# Altium schematic sheet Radar_FMCW.SchDoc
size A3; SheetNumber: 1; SheetTotal: 1
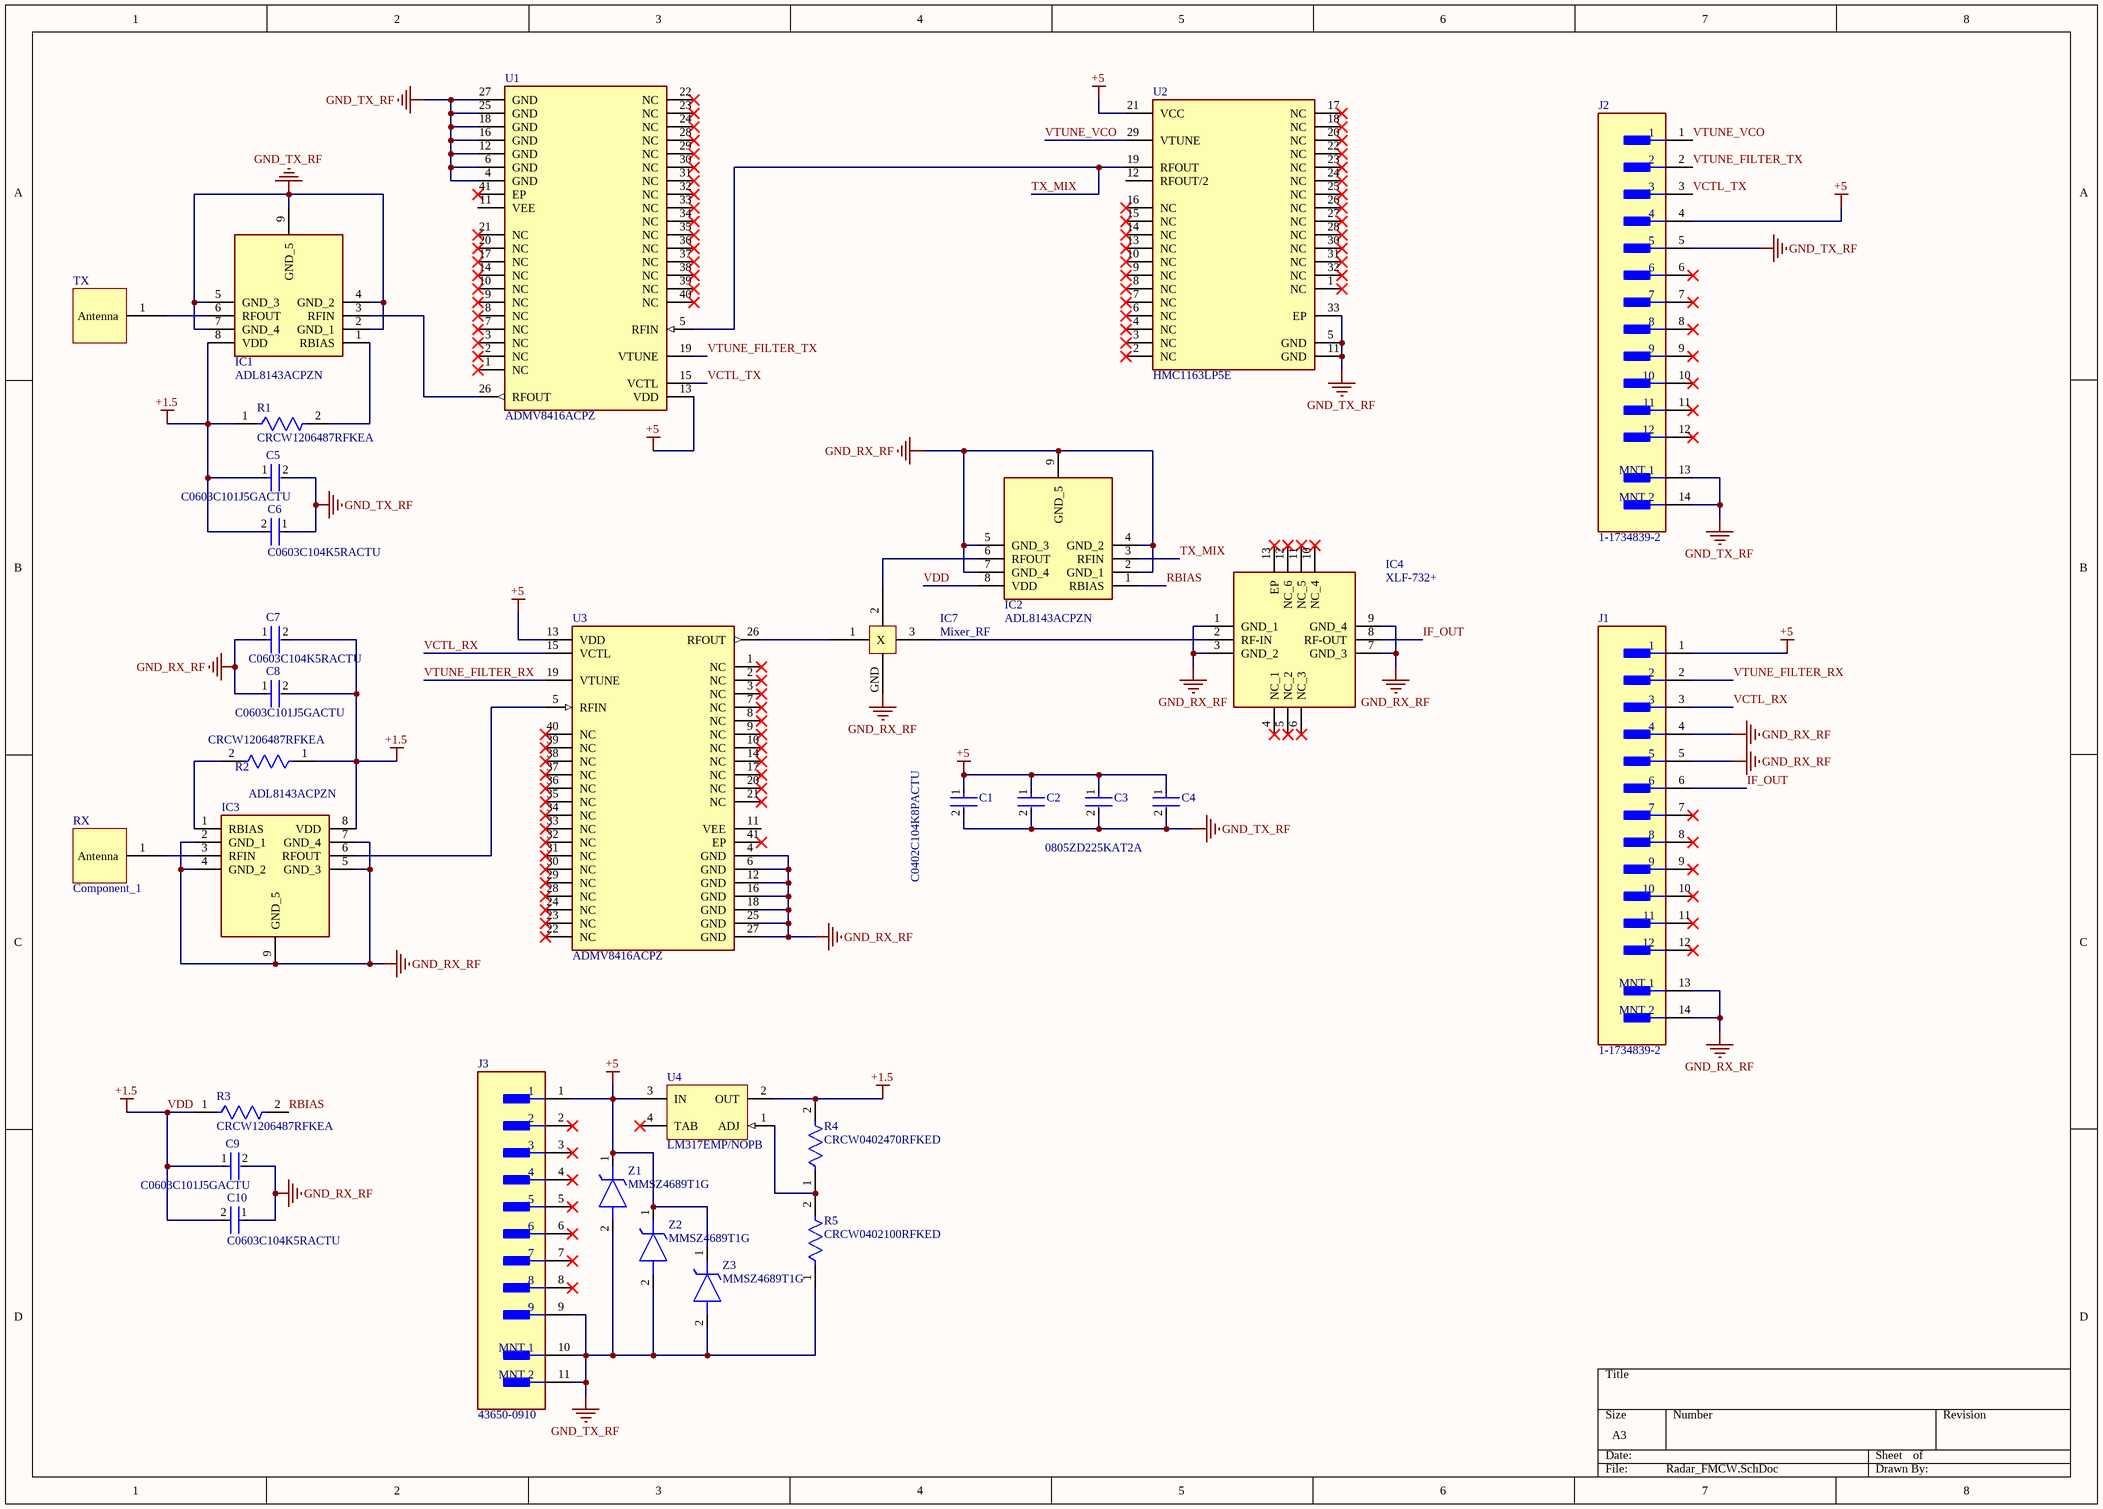
[diagram p0: Radar_FMCW.SchDoc]

## Parts
C1  C0402C104K8PACTU  [FP-C0402-BB-MFG]
C2  (no value)  [FP-0805-L_2_01_0_2-W_1_25-IPC_B]
C3  (no value)  [FP-0805-L_2_01_0_2-W_1_25-IPC_B]
C4  0805ZD225KAT2A  [FP-0805-L_2_01_0_2-W_1_25-IPC_B]
C5  C0603C101J5GACTU  [FP-C0603C-CF-MFG]
C6  C0603C104K5RACTU  [FP-C0603C-CF-MFG]
C7  C0603C104K5RACTU  [FP-C0603C-CF-MFG]
C8  C0603C101J5GACTU  [FP-C0603C-CF-MFG]
C9  C0603C101J5GACTU  [FP-C0603C-CF-MFG]
C10  C0603C104K5RACTU  [FP-C0603C-CF-MFG]
IC1  ADL8143ACPZN  [SON50P200X200X90-9N-D]
IC2  ADL8143ACPZN  [SON50P200X200X90-9N-D]
IC3  ADL8143ACPZN  [SON50P200X200X90-9N-D]
IC4  XLF-732+  [QFN51P300X300X89-13N]
IC7  Mixer_RF  [Mixer_RF]
J1  1-1734839-2  [FP-1-1734839-2-MFG]
J2  1-1734839-2  [FP-1-1734839-2-MFG]
J3  43650-0910  [FP-43650-0910-MFG]
R1  CRCW1206487RFKEA  [FP-CRCW1206-e3-MFG]
R2  CRCW1206487RFKEA  [FP-CRCW1206-e3-MFG]
R3  CRCW1206487RFKEA  [FP-CRCW1206-e3-MFG]
R4  CRCW0402470RFKED  [FP-CRCW0402-e3-MFG]
R5  CRCW0402100RFKED  [FP-CRCW0402-e3-IPC_C]
RX  Component_1  [Antenna_10GHz]
TX  (no value)  [Antenna_10GHz]
U1  ADMV8416ACPZ  [FP-CP-40-27-IPC_C]
U2  HMC1163LP5E  [FP-HCP-32-1-IPC_B]
U3  ADMV8416ACPZ  [FP-CP-40-27-IPC_C]
U4  LM317EMP/NOPB  [DCY0004A_L]
Z1  MMSZ4689T1G  [SOD3716X135N]
Z2  MMSZ4689T1G  [SOD3716X135N]
Z3  MMSZ4689T1G  [SOD3716X135N]

## Nets
+5: C1.1 C2.1 C3.1 C4.1 J1.1 J2.4 J3.1 U1.13(VDD) U2.21(VCC) U3.13(VDD) U4.3(IN) Z1.1(K) Z2.1(K) Z3.1(K)
GND_RX_RF: C7.1 C8.1 C9.2 C10.1 IC2.2(GND_1) IC2.4(GND_2) IC2.5(GND_3) IC2.7(GND_4) IC2.9(GND_5) IC3.2(GND_1) IC3.4(GND_2) IC3.5(GND_3) IC3.7(GND_4) IC3.9(GND_5) IC4.1(GND_1) IC4.3(GND_2) IC4.7(GND_3) IC4.9(GND_4) IC7.GND J1.4 J1.5 J1.13(MNT_1) J1.14(MNT_2) U3.4(GND) U3.6(GND) U3.12(GND) U3.16(GND) U3.18(GND) U3.25(GND) U3.27(GND)
GND_TX_RF: C1.2 C2.2 C3.2 C4.2 C5.2 C6.1 IC1.2(GND_1) IC1.4(GND_2) IC1.5(GND_3) IC1.7(GND_4) IC1.9(GND_5) J2.5 J2.13(MNT_1) J2.14(MNT_2) J3.9 J3.10(MNT_1) J3.11(MNT_2) R5.1 U1.4(GND) U1.6(GND) U1.12(GND) U1.16(GND) U1.18(GND) U1.25(GND) U1.27(GND) U2.5(GND) U2.11(GND) U2.33(EP) Z1.2(A) Z2.2(A) Z3.2(A)
VDD: C5.1 C6.2 C7.2 C8.2 C9.1 C10.2 IC1.8(VDD) IC2.8(VDD) IC3.8(VDD) R1.1 R2.1 R3.1 R4.2 U4.2(OUT)  [also labelled +1.5]
IF_OUT: IC4.8(RF-OUT) J1.6
RBIAS: IC2.1(RBIAS) R3.2
TX_MIX: IC2.3(RFIN) U1.5(RFIN) U2.19(RFOUT)
VCTL_RX: J1.3 U3.15(VCTL)
VCTL_TX: J2.3 U1.15(VCTL)
VTUNE_FILTER_RX: J1.2 U3.19(VTUNE)
VTUNE_FILTER_TX: J2.2 U1.19(VTUNE)
VTUNE_VCO: J2.1 U2.29(VTUNE)
NetIC1_1: IC1.1(RBIAS) R1.2
NetIC1_3: IC1.3(RFIN) U1.26(RFOUT)
NetIC1_6: IC1.6(RFOUT) TX.1(Antenna)
NetIC2_6: IC2.6(RFOUT) IC7.2
NetIC3_1: IC3.1(RBIAS) R2.2
NetIC3_3: IC3.3(RFIN) RX.1(Antenna)
NetIC3_6: IC3.6(RFOUT) U3.5(RFIN)
NetIC4_2: IC4.2(RF-IN) IC7.3
NetIC7_1: IC7.1(X) U3.26(RFOUT)
NetR4_1: R4.1 R5.2 U4.1(ADJ)

Not connected (* = marked no-connect by the designer): IC4 4(NC_1)* 5(NC_2)* 6(NC_3)* 10(NC_4)* 11(NC_5)* 12(NC_6)* 13(EP)*; J1 7* 8* 9* 10* 11* 12*; J2 6* 7* 8* 9* 10* 11* 12*; J3 2* 3* 4* 5* 6* 7* 8*; U1 1(NC)* 2(NC)* 3(NC)* 7(NC)* 8(NC)* 9(NC)* 10(NC)* 11(VEE) 14(NC)* 17(NC)* 20(NC)* 21(NC)* 22(NC)* 23(NC)* 24(NC)* 28(NC)* 29(NC)* 30(NC)* 31(NC)* 32(NC)* 33(NC)* 34(NC)* 35(NC)* 36(NC)* 37(NC)* 38(NC)* 39(NC)* 40(NC)* 41(EP)*; U2 1(NC)* 2(NC)* 3(NC)* 4(NC)* 6(NC)* 7(NC)* 8(NC)* 9(NC)* 10(NC)* 12(RFOUT/2) 13(NC)* 14(NC)* 15(NC)* 16(NC)* 17(NC)* 18(NC)* 20(NC)* 22(NC)* 23(NC)* 24(NC)* 25(NC)* 26(NC)* 27(NC)* 28(NC)* 30(NC)* 31(NC)* 32(NC)*; U3 1(NC)* 2(NC)* 3(NC)* 7(NC)* 8(NC)* 9(NC)* 10(NC)* 11(VEE) 14(NC)* 17(NC)* 20(NC)* 21(NC)* 22(NC)* 23(NC)* 24(NC)* 28(NC)* 29(NC)* 30(NC)* 31(NC)* 32(NC)* 33(NC)* 34(NC)* 35(NC)* 36(NC)* 37(NC)* 38(NC)* 39(NC)* 40(NC)* 41(EP)*; U4 4(TAB)*

## Library data of the parts
C1 = CMP-2008-02046-2: CAP CER 0.1UF 10V X5R 0402; Manufacturer: Kemet; Material: Ceramic; Capacitance: 0.10 μF; Temperature Coefficient: 15%; Tolerance: 0.1; Value: 0.10 μF; Package: C0402-BB; Temperature: -55°C to +125°C; ComponentLink2Description: Datasheet; Temperature Characteristic: X5R; Device Class L1: Passive Components; Height: 0.55mm; Lead Free: Yes; ComponentLink2URL: https://content.kemet.com/datasheets/KEM_C1002_X7R_SMD.pdf; Device Class L2: Capacitors; Temperature Range Low: -55°C; Temperature Range High: +125°C; RoHS: TRUE; Octopart: https://octopart.com/c0402c104k8pactu-kemet-140039; Automotive: No; Mouser Description: Capacitor 100 nF 10 VDC 0402; Category: Cap; Voltage Rating: 10 V; Digikey Description: CAP CER 0.1UF 10V X5R 0402; Ipc Land Pattern Name: CAPC10050X50; Device Class L3: Ceramic Capacitors; Manufacturer Part Number: C0402C104K8PACTU
C2-C4 = CMP-2000-05810-2: General Purpose Ceramic Capacitor, 0805, 2.2uF, 10%, X5R, 15%, 10V; Insulation Resistance: 500MR; Dissipation Factor: 5%; Termination: SMD/SMT; Length: 2.01mm; Lead Free: Lead Free; Voltage: 10V; Height: 1.4mm; Contact Plating: Tin; Dielectric: X5R; Voltage Rating (DC): 10V; REACH SVHC: No SVHC; Voltage Rating: 10V; Depth: 1.25mm; Min Operating Temperature: -55°C; Tolerance: 10%; Case Code (Metric): 2012; Max Operating Temperature: 85°C; Radiation Hardening: No; Dielectric Material: Ceramic; Packaging: Tape and Reel; Construction: Flat; Case Code (Imperial): 0805; RoHS Compliant: Yes; Package Quantity: 1; Capacitance: 2.2uF; Series: -; Size: 1.4mm; Number of Pins: 2; Width: 0.049inch; Mount: Surface Mount; Thickness: 0.055inch; Case/Package: 0805
C5 C8 C9 = CMP-2006-03408-2: CAP CER 100PF 50V C0G/NP0 0603; Manufacturer: KEMET; Material: Ceramic; Tolerance: 0.05; Automotive Grade: Grade 1; Temperature Coefficient: 30ppm/°C; Temperature Characteristic: C0G; RoHS: TRUE; Temperature Range Low: -55°C; Automotive: Yes; Digikey Description: CAP CER 100PF 50V C0G/NP0 0603; Voltage Rating: 50 V; Lead Free: Yes; Category: Cap; Manufacturer Part Number: C0603C101J5GACTU; Device Class L3: Ceramic Capacitors; Mouser Description: Multilayer Ceramic Capacitor, C Series, 100 Pf, - 5%, C0g / Np0, 50 V, 0603 [1608 Metric] Rohs Compliant: Yes; Value: 100 pF; Device Class L1: Passive Components; Temperature: -55°C to +125°C; ComponentLink2URL: https://api.kemet.com/component-edge/download/datasheet/C0603C100J5GACAUTO.pdf; Temperature Range High: +125°C; ComponentLink2Description: Datasheet; Octopart: https://octopart.com/c0603c101j5gactu-kemet-100052; Device Class L2: Capacitors; Height: 0.87mm; Capacitance: 100 pF; Package: C0603C-CF
C6 C7 C10 = CMP-2006-03061-2: CAP CER 0.1UF 50V X7R 0603; Manufacturer: KEMET; Tolerance: 0.1; Temperature Coefficient: 30ppm/°C; Material: Ceramic; Automotive Grade: Grade 1; Value: 0.10 μF; Temperature: -55°C to +125°C; RoHS: TRUE; Temperature Range High: +125°C; Lead Free: Yes; Octopart: https://octopart.com/c0603c104k5ractu-kemet-139244; Digikey Description: CAP CER 0.1UF 50V X7R 0603; Category: Cap; Package: C0603C-CF; ComponentLink2Description: Datasheet; Temperature Range Low: -55°C; Device Class L1: Passive Components; Voltage Rating: 50 V; Automotive: Yes; Device Class L3: Ceramic Capacitors; ComponentLink2URL: https://api.kemet.com/component-edge/download/datasheet/C0603C100J5GACAUTO.pdf; Capacitance: 0.10 μF; Device Class L2: Capacitors; Manufacturer Part Number: C0603C104K5RACTU; Temperature Characteristic: X7R; Height: 0.87mm
IC1-IC3 = ADL8143ACPZN: Integrated Circuit; Manufacturer_Name: Analog Devices; Datasheet Link: https://www.analog.com/ADL8143/datasheet; Height: 0.9mm; Manufacturer_Part_Number: ADL8143ACPZN
IC4 = XLF-732+: Integrated Circuit; Manufacturer_Name: Mini-Circuits; Datasheet Link: https://www.minicircuits.com/WebStore/dashboardPdf?model=XLF-732%2B; Height: 0.89mm; Manufacturer_Part_Number: XLF-732+; Mouser Part Number: 139-XLF-732; Mouser Price/Stock: https://www.mouser.co.uk/ProductDetail/Mini-Circuits/XLF-732%2b?qs=xZ%2FP%252Ba9zWqZ1H%2Fab09yzWw%3D%3D
J1 J2 = CMP-03368-000004-1: CONN FPC TOP 12POS 0.50MM R/A; Contact Current Rating: 500mA; Actuator Color: Beige; Pitch: 0.5mm; Number of Positions: 12; Connector Type: Receptacle; Connector System: Flex-to-Board; PCB Mount Retention: With; Shielding: Unshielded; PCB Mounting Orientation: Right Angle; PCB Mount Alignment: No (Without); Shrouded: Yes (With); Actuator Material: Thermoplastic; Wire/Cable Type: Flat Flex; Voltage Rating: 250V; Height: 2.05mm; Packaging: Tape and Reel; Orientation: Right Angle; Contact Plating: Gold; Mount: Surface Mount; Flammability Rating: UL94 V-0; Number of Rows: 1; RoHS Compliant: Yes; Length: 11.43mm; Radiation Hardening: No; Housing Material: Polymer; Series: -; Contact Material: Bronze; Gender: Receptacle; Termination: SMD/SMT; Current Rating: 500mA; Package Quantity: 2000; Min Operating Temperature: -40°C; Housing Color: Natural; Contact Location: Top; Sealable: No (Without); Mating Alignment: Yes (With); Depth: 5.1mm; Number of Contacts: 12; Width: 5.1mm; Max Operating Temperature: 85°C
J3 = CMP-00257-00277514-1: 43650-0910 Conn Power HDR 9 POS 3mm Solder RA SMD 9 Terminal 1 Port Micro-Fit 3.0™ Embossed T/R; NexarPartId: 277514; Manufacturer Lifecycle Status: ACTIVE; Plating: Tin; Gender: Male; Number of Positions: 9; Current Rating: 5A; Voltage Rating (DC): 250V; Glow Wire Compliant: Compliant; Connector Type: Male Pin; Max Operating Temperature: 105°C; Lifecycle Status: Production; Housing Color: Black; Orientation: Right Angle; Country of Origin: US; Pitch: 3mm; Termination: Solder; Number of Rows: 1; Housing Material: Thermoplastic; Min Operating Temperature: -40°C; Contact Material: Brass; Halogen Free: Low Halogen; Flammability Rating: UL94 V-0; Fastening Type: Ramp; Lead Free: Contains Lead; Lead Pitch: 3mm; Max Voltage Rating (AC): 250V; Voltage Rating: 250V; Number of Contacts: 9; Color: Black; Number of Circuits: 9; Contact Plating: Gold; RoHS: Compliant; Mount: Surface Mount
R1-R3 = CMP-2003-02220-2: RES Thick Film, 487Ω, 1%, 0.25W, 100ppm/°C, 1206; Resistance: 487R; Voltage Rating (DC): 200V; Max Power Dissipation: 250mW; Length: 3.2mm; Package Quantity: 10; Number of Terminations: 2; Weight: 0.000353oz; Military Standard: Not; Number of Pins: 2; Packaging: Tape and Reel; Termination: SMD/SMT; Case/Package: 1206; Temperature Coefficient: 100ppm/°C; Contact Plating: Tin; Radiation Hardening: No; Height: 0.024inch; Composition: Thick Film; Depth: 1.6mm; Case Code (Metric): 3216; Min Operating Temperature: -55°C; Tolerance: 1%; Width: 0.063inch; Power Rating: 250mW; Features: Automotive AEC-Q200; Voltage Rating: 200V; Max Operating Temperature: 155°C; Lead Free: Lead Free; Case Code (Imperial): 1206
R4 = CMP-2002-00022-2: RES Thick Film, 470Ω, 1%, 0.063W, 100ppm/°C, 0402; Power Rating: 63mW; Voltage Rating (DC): 50V; Resistance: 470R; Case Code (Imperial): 0402; Tolerance: 1%; Lead Free: Lead Free; Max Operating Temperature: 155°C; Military Standard: Not; Height: 0.35mm; Termination: SMD/SMT; Mount: Surface Mount; Features: Automotive AEC-Q200; Composition: Thick Film; Temperature Coefficient: 100ppm/°C; Case Code (Metric): 1005; Package Quantity: 10; Radiation Hardening: No; Max Power Dissipation: 63mW; Weight: 2.3E-05oz; Width: 0.5mm; Length: 1mm; Depth: 0.5mm; Min Operating Temperature: -55°C; Voltage Rating: 50V; Case/Package: 0402; Packaging: Tape and Reel; Contact Plating: Tin; Number of Terminations: 2
R5 = CMP-1011-00397-3: RES Thick Film, 100Ω, 1%, 0.063W, 100ppm/°C, 0402; Max Power Dissipation: 63mW; Voltage Rating: 50V; Resistance: 100R; Package Quantity: 10; Lead Free: Lead Free; Termination: SMD/SMT; Case Code (Metric): 1005; Number of Terminations: 2; Composition: Thick Film; Voltage Rating (DC): 50V; Min Operating Temperature: -55°C; Case/Package: 0402; Radiation Hardening: No; Max Operating Temperature: 155°C; Temperature Coefficient: 100ppm/°C; Military Standard: Not; Length: 1mm; Mount: Surface Mount; Power Rating: 63mW; Weight: 2.3E-05oz; Working Voltage: 50V; Features: Automotive AEC-Q200; Depth: 0.5mm; Packaging: Tape and Reel; Tolerance: 1%; Height: 0.35mm; Case Code (Imperial): 0402; Width: 0.02inch; Contact Plating: Tin
TX = Component_1
U1 U3 = CMP-09093-000060-1: 8 TO 16 GHZ TUNABLE BPF; RoHS Compliant: Yes
U2 = CMP-09142-000244-1: IC VCO VSAT 9.65-10.41GHZ 32CSP; Operating Supply Current: 230mA; Gain: 11dB; P1dB: 11dBm; RoHS Compliant: Yes; Packaging: Strip; Lead Free: Contains Lead; Frequency: 10.41GHz; Number of Pins: 32; Series: -
U4 = CMP-0062-01707-3: 3-Terminal Adjustable Regulator, 4-pin SOT-223, Pb-Free; Manufacturer: Texas Instruments; PowerWise: N; PackageTopMarking: XYTT*N01A; CompType: LDO IC; PackageDescription: Molded SOT-223, 6.50 x 3.56 x 1.6mm Body, 4 Lead, 2.3mm Pitch; Code_IPC: SOT223-4; ComponentLink1Description: Datasheet URL; Code_JEDEC: TO-261-AA; ComponentLink1URL: http://www.ti.com/general/docs/lit/getliterature.tsp?genericPartNumber=LM317-N&fileType=pdf; RoHS: Y; PinCount: 4; PackageReference: DCY0004A
Z1-Z3 = MMSZ4689T1G: Zener Diode; Manufacturer_Name: onsemi; Datasheet Link: http://www.onsemi.com/pub/Collateral/MMSZ4678T1-D.PDF; Height: 1.35mm; Manufacturer_Part_Number: MMSZ4689T1G; Mouser Part Number: 863-MMSZ4689T1G; Mouser Price/Stock: https://www.mouser.co.uk/ProductDetail/onsemi/MMSZ4689T1G?qs=P4IOph%252Bbot%252Blaz%2FZtdyBaA%3D%3D; Arrow Part Number: MMSZ4689T1G; Arrow Price/Stock: https://www.arrow.com/en/products/mmsz4689t1g/on-semiconductor?region=nac